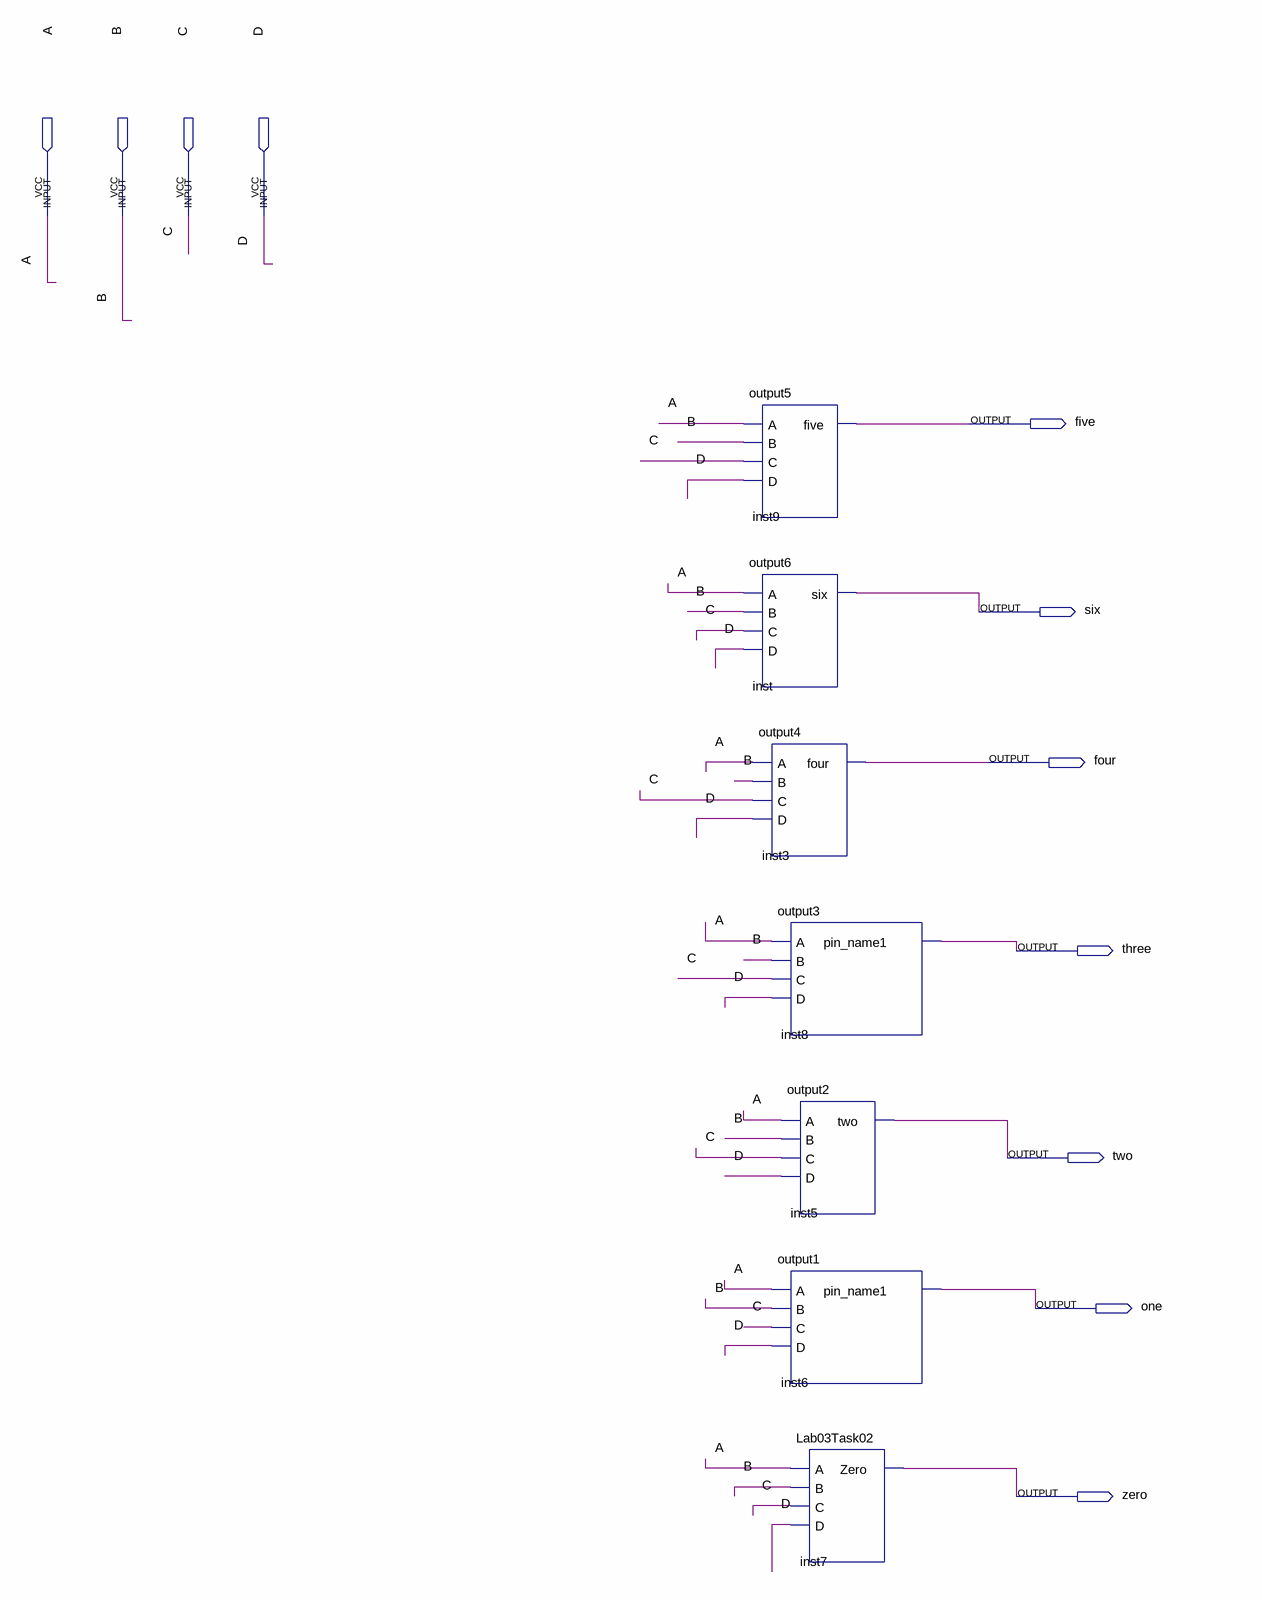
[diagram p0: schematic sheet]
// Quartus schematic outputFin.bdf as structural Verilog: 7 symbols, 11 pins
module outputFin (
  input  A,
  input  B,
  input  C,
  input  D,
  output five,
  output six,
  output four,
  output three,
  output two,
  output one,
  output zero
);

  output5 inst9 (.A(A), .B(B), .C(C), .D(D), .five(five));
  output6 inst (.A(A), .B(B), .C(C), .D(D), .six(six));
  output4 inst3 (.A(A), .B(B), .C(C), .D(D), .four(four));
  output3 inst8 (.A(A), .B(B), .C(C), .D(D), .pin_name1(three));
  output2 inst5 (.A(A), .B(B), .C(C), .D(D), .two(two));
  output1 inst6 (.A(A), .B(B), .C(C), .D(D), .pin_name1(one));
  Lab03Task02 inst7 (.A(A), .B(B), .C(C), .D(D), .Zero(zero));
endmodule
